# Altium schematic sheet antenna_bias.SchDoc
size A4; SheetNumber: 3; SheetTotal: 3
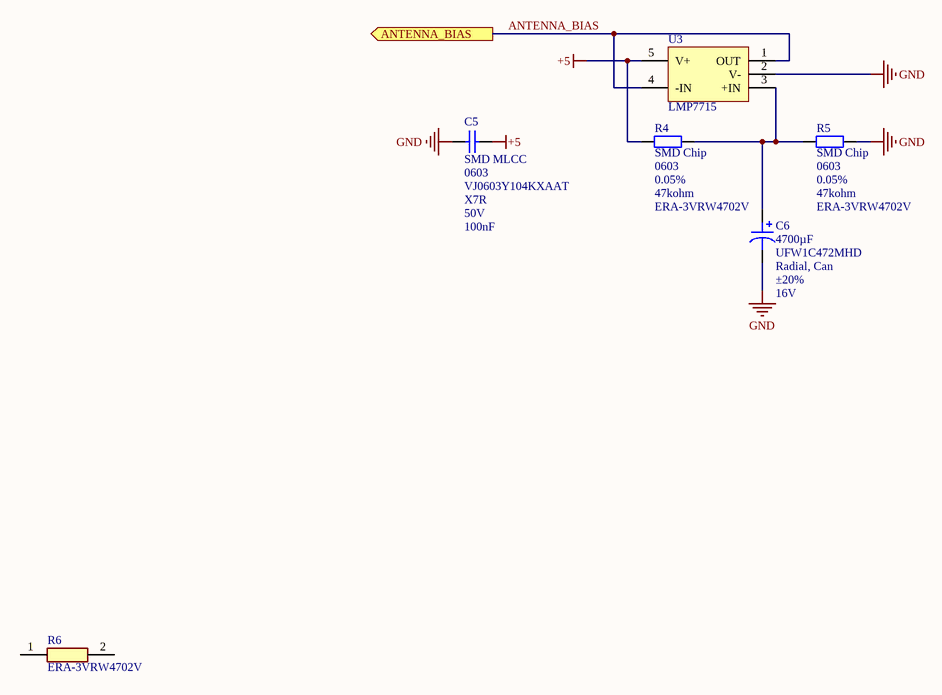
[diagram p0: antenna_bias.SchDoc]

## Parts
C5  SMD MLCC  Size: 0603  Part Number: VJ0603Y104KXAAT  Dielectric: X7R  VoltageRating: 50V  Capacitance: 100nF  [SMD_MLCC_CAPACITOR_0603]
C6  4700µF  Part Number: UFW1C472MHD  Package / Case: Radial, Can  Tolerance: ±20%  Voltage - Rated: 16V  [CAP TH ALUM ELEC D16.00mm S7.50mm H25.00mm]
R4  SMD Chip  Size: 0603  Tolerance: 0.05%  Resistance: 47kohm  Part Number: ERA-3VRW4702V  [SMD_CHIP_RESISTOR_0603]
R5  SMD Chip  Size: 0603  Tolerance: 0.05%  Resistance: 47kohm  Part Number: ERA-3VRW4702V  [SMD_CHIP_RESISTOR_0603]
R6  ERA-3VRW4702V  [ERA3KV_(0603)]
U3  LMP7715  [LMP7715]

## Ports
ANTENNA_BIAS (out)

## Nets
+5: C5.1 R4.1 U3.5(V+)
GND: C5.2 C6.2 R5.2 U3.2(V-)
ANTENNA_BIAS: U3.1(OUT) U3.4(-IN) ; port ANTENNA_BIAS
NetC6_1: C6.1 R4.2 R5.1 U3.3(+IN)

Not connected (* = marked no-connect by the designer): R6 1 2

## Library data of the parts
C5 = SMD MLCC Capacitor: generic SMD MLCC capacitor
C6 = UFW1C472MHD: CAP ALUM 4700UF 20% 16V RADIAL; manufacturer: Nichicon; Lifetime @ Temp.: 2000 Hrs @ 85°C; Polarization: Polar; Ripple Current @ High Frequency: 2.415A @ 10kHz; Ripple Current @ Low Frequency: 2.1A @ 120Hz; Applications: Audio; Capacitance: 4700µF; componentlink1description: Datasheet; componentlink1url: http://nichicon-us.com/english/products/pdfs/e-ufw.pdf; componentlink2description: DigiKey Link; componentlink2url: http://digikey.com/product-detail/en/nichicon/UFW1C472MHD/493-3178-ND/1965200; Device Package: Radial, Can; Height - Seated (Max): 0.984" (25.00mm); lastupdated: 2. 09. 2020 01:32:49; Lead Spacing: 0.295" (7.50mm); Lifecycle Status: Active; Minimum Order: 1; Mounting Type: Through Hole; Operating Temperature: -40°C ~ 85°C; packaging: Bulk; partid: 16502; Part Status: Active; price: 1.10; series: UFW; Size / Dimension: 0.630" Dia (16.00mm); Supplier 1: DigiKey; Supplier Part Number 1: 493-3178-ND; value: 4700µF
R4 R5 = SMD Chip Resistor: generic SMD chip resistor
R6 = ERA-3VRW4702V: Resistor; Manufacturer_Name: Panasonic; Datasheet Link: http://industrial.panasonic.com/cdbs/www-data/pdf/RDM0000/RDM0000C331.pdf; Height: 0.4mm; Manufacturer_Part_Number: ERA-3VRW4702V
U3 = LMP7715: Precision, 17 MHz, Low Noise, CMOS Input Amplifier